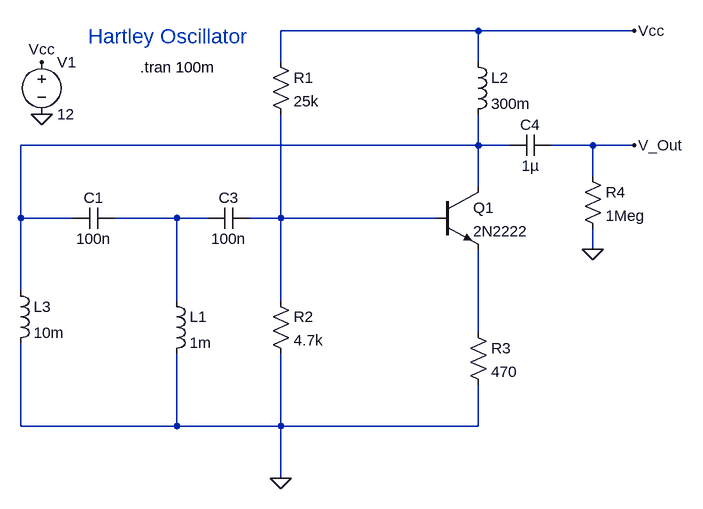
[diagram p0: schematic Hartley.asc]
Hartley.asc, the LTspice schematic file:
Version 4.1
SHEET 1 880 680
WIRE 368 -144 64 -144
WIRE 608 -144 368 -144
WIRE 64 -96 64 -144
WIRE 368 -96 368 -144
WIRE 368 32 368 -16
WIRE 368 32 -336 32
WIRE 416 32 368 32
WIRE 544 32 480 32
WIRE 608 32 544 32
WIRE 544 80 544 32
WIRE 368 96 368 32
WIRE -336 144 -336 32
WIRE -256 144 -336 144
WIRE -96 144 -192 144
WIRE -48 144 -96 144
WIRE 64 144 64 -16
WIRE 64 144 16 144
WIRE 304 144 64 144
WIRE 544 192 544 160
WIRE -336 256 -336 144
WIRE -96 272 -96 144
WIRE 64 272 64 144
WIRE 368 320 368 192
WIRE -336 464 -336 336
WIRE -96 464 -96 352
WIRE -96 464 -336 464
WIRE 64 464 64 352
WIRE 64 464 -96 464
WIRE 368 464 368 400
WIRE 368 464 64 464
WIRE 64 544 64 464
FLAG 64 544 0
FLAG -304 -16 0
FLAG -304 -96 Vcc
FLAG 608 -144 Vcc
FLAG 608 32 V_Out
FLAG 544 192 0
SYMBOL npn 304 96 R0
SYMATTR InstName Q1
SYMATTR Value 2N2222
SYMBOL voltage -304 -112 R0
WINDOW 123 0 0 Left 0
WINDOW 39 0 0 Left 0
SYMATTR InstName V1
SYMATTR Value 12
SYMBOL cap -48 160 R270
WINDOW 0 32 32 VTop 2
WINDOW 3 0 32 VBottom 2
SYMATTR InstName C3
SYMATTR Value 100n
SYMBOL cap 416 48 R270
WINDOW 0 32 32 VTop 2
WINDOW 3 0 32 VBottom 2
SYMATTR InstName C4
SYMATTR Value 1µ
SYMBOL res 48 -112 R0
SYMATTR InstName R1
SYMATTR Value 25k
SYMBOL res 48 256 R0
SYMATTR InstName R2
SYMATTR Value 4.7k
SYMBOL res 352 304 R0
SYMATTR InstName R3
SYMATTR Value 470
SYMBOL ind 352 -112 R0
SYMATTR InstName L2
SYMATTR Value 300m
SYMATTR SpiceLine Rser=1m
SYMBOL res 528 64 R0
SYMATTR InstName R4
SYMATTR Value 1Meg
SYMBOL ind -112 256 R0
SYMATTR InstName L1
SYMATTR Value 1m
SYMATTR SpiceLine Rser=1m
SYMBOL ind -352 240 R0
SYMATTR InstName L3
SYMATTR Value 10m
SYMATTR SpiceLine Rser=1m
SYMBOL cap -192 128 R90
WINDOW 0 0 32 VBottom 2
WINDOW 3 32 32 VTop 2
SYMATTR InstName C1
SYMATTR Value 100n
TEXT -232 -136 Left 3 ;Hartley Oscillator
TEXT -152 -88 Left 2 !.tran 100m

The netlist it stands for:
* Hartley.asc
Q1 N001 N003 N004 0 2N2222
V1 Vcc 0 12
C3 N002 N003 100n
C4 N001 V_Out 1µ
R1 Vcc N003 25k
R2 N003 0 4.7k
R3 N004 0 470
L2 Vcc N001 300m Rser=1m
R4 V_Out 0 1Meg
L1 N002 0 1m Rser=1m
L3 N001 0 10m Rser=1m
C1 N002 N001 100n
.model NPN NPN
.model PNP PNP
.lib standard.bjt
* Hartley Oscillator
.tran 100m
.backanno
.end